# EAGLE design extio (EAGLE 7.1.0)
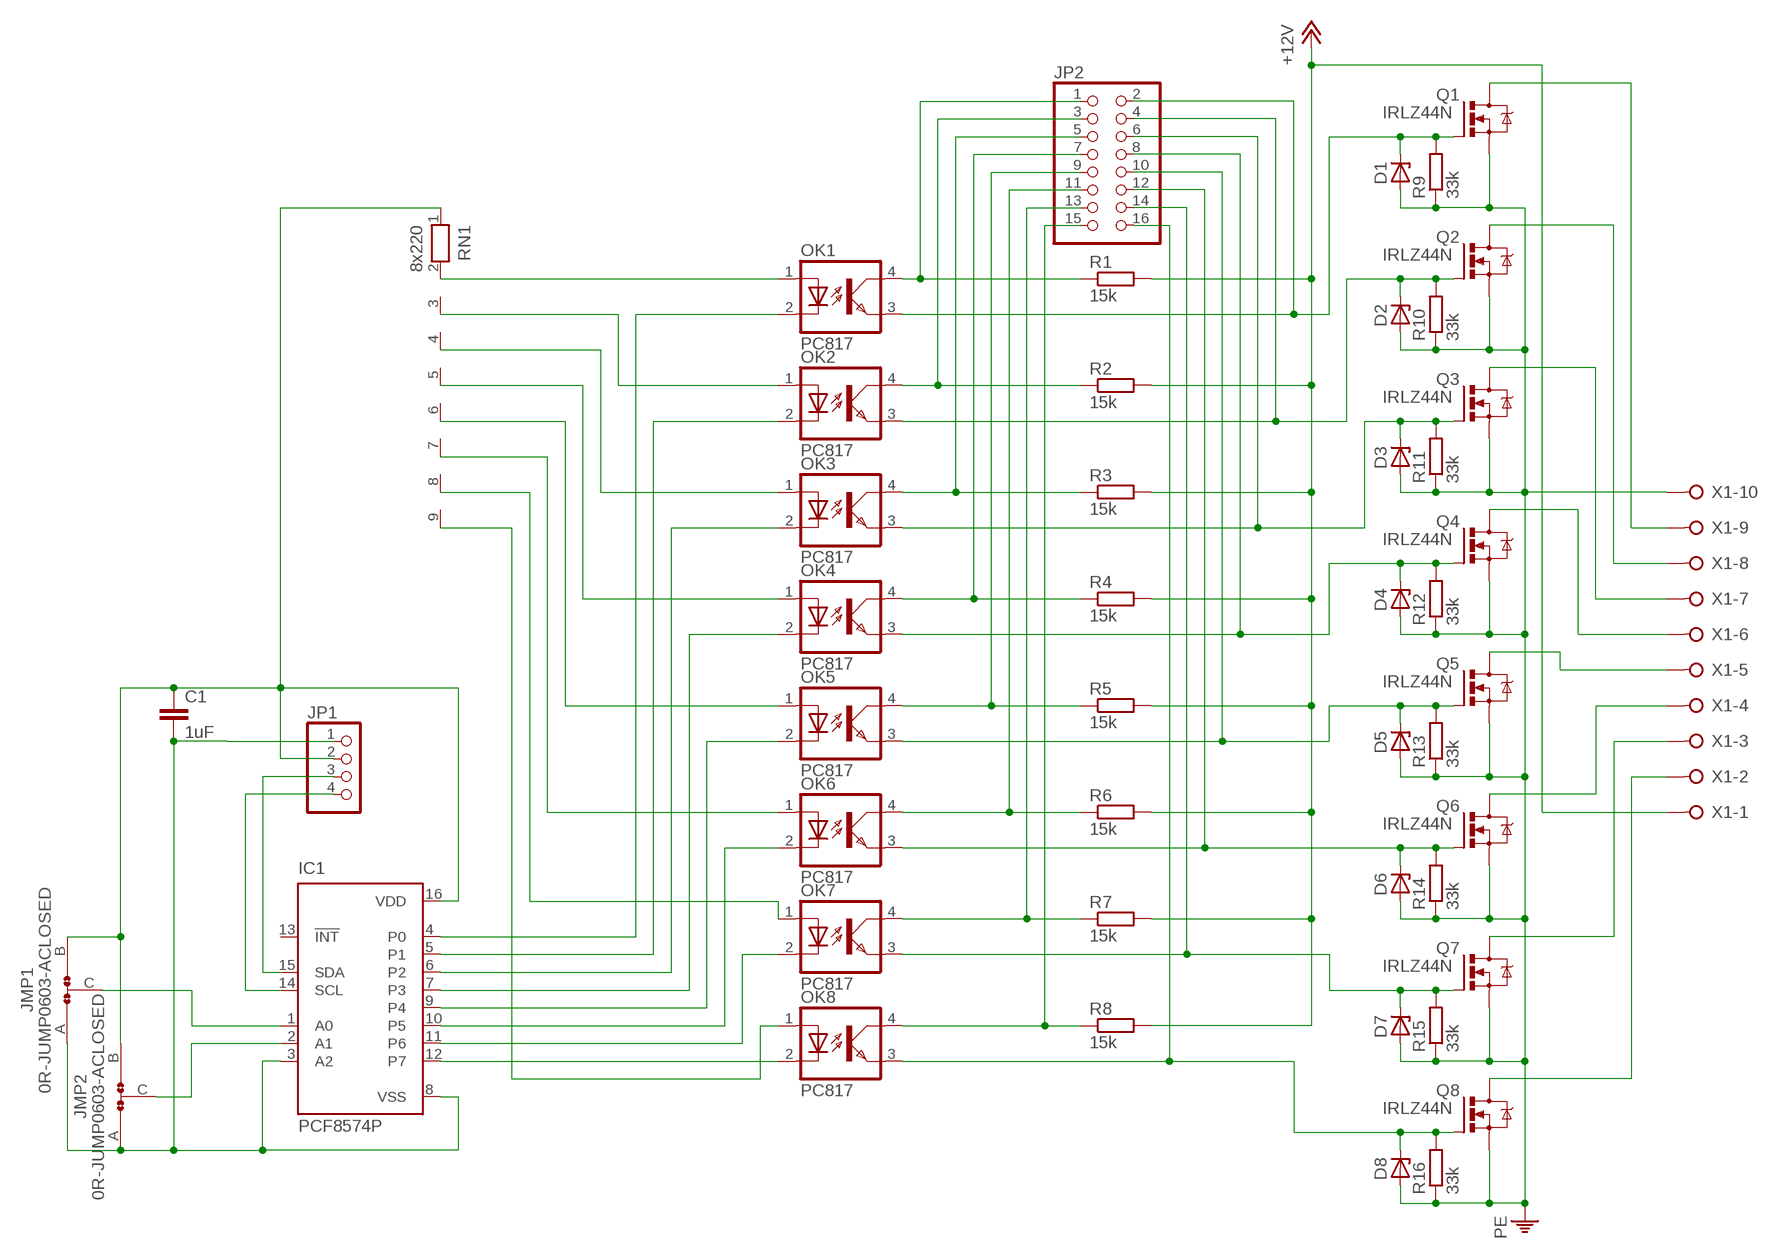
[diagram p0: schematic, sheet 1]

## Parts
C1  1uF  C-EUC0603  [C0603]
D1  ZENER-DIODESOD80C  [SOD80C]
D2  ZENER-DIODESOD80C  [SOD80C]
D3  ZENER-DIODESOD80C  [SOD80C]
D4  ZENER-DIODESOD80C  [SOD80C]
D5  ZENER-DIODESOD80C  [SOD80C]
D6  ZENER-DIODESOD80C  [SOD80C]
D7  ZENER-DIODESOD80C  [SOD80C]
D8  ZENER-DIODESOD80C  [SOD80C]
IC1  PCF8574P  [DIL16]
JMP1  0R-JUMP0603-ACLOSED  [JMP0603-ACLOSED]
JMP2  0R-JUMP0603-ACLOSED  [JMP0603-ACLOSED]
JP1  PINHD-1X4  [1X04]
JP2  PINHD-2X8  [2X08]
OK1  PC817  [DIL04]
OK2  PC817  [DIL04]
OK3  PC817  [DIL04]
OK4  PC817  [DIL04]
OK5  PC817  [DIL04]
OK6  PC817  [DIL04]
OK7  PC817  [DIL04]
OK8  PC817  [DIL04]
Q1  IRLZ44N  [TO220V]
Q2  IRLZ44N  [TO220V]
Q3  IRLZ44N  [TO220V]
Q4  IRLZ44N  [TO220V]
Q5  IRLZ44N  [TO220V]
Q6  IRLZ44N  [TO220V]
Q7  IRLZ44N  [TO220V]
Q8  IRLZ44N  [TO220V]
R1  15k  R-EU_R0603  [R0603]
R2  15k  R-EU_R0603  [R0603]
R3  15k  R-EU_R0603  [R0603]
R4  15k  R-EU_R0603  [R0603]
R5  15k  R-EU_R0603  [R0603]
R6  15k  R-EU_R0603  [R0603]
R7  15k  R-EU_R0603  [R0603]
R8  15k  R-EU_R0603  [R0603]
R9  33k  R-EU_R0603  [R0603]
R10  33k  R-EU_R0603  [R0603]
R11  33k  R-EU_R0603  [R0603]
R12  33k  R-EU_R0603  [R0603]
R13  33k  R-EU_R0603  [R0603]
R14  33k  R-EU_R0603  [R0603]
R15  33k  R-EU_R0603  [R0603]
R16  33k  R-EU_R0603  [R0603]
RN1  8x220  RN08  [RN-9]
X1  W237-10P  [W237-10P]

## Nets
+12V: R1.2 R2.2 R3.2 R4.2 R5.2 R6.2 R7.2 R8.2 X1.1
GND: C1.2 IC1.3(A2) IC1.8(VSS) JMP1.A JMP2.A JP1.1
N$2: IC1.1(A0) JMP1.C
N$3: IC1.2(A1) JMP2.C
N$13: OK1.1(A) RN1.2
N$20: Q1.2(D) X1.9
N$21: JP2.1 OK1.4(COL) R1.1
N$22: JP2.3 OK2.4(COL) R2.1
N$23: JP2.5 OK3.4(COL) R3.1
N$24: JP2.7 OK4.4(COL) R4.1
N$25: JP2.9 OK5.4(COL) R5.1
N$26: JP2.11 OK6.4(COL) R6.1
N$27: JP2.13 OK7.4(COL) R7.1
N$31: IC1.12(P7) OK8.2(C)
N$32: IC1.11(P6) OK7.2(C)
N$34: IC1.10(P5) OK6.2(C)
N$35: IC1.9(P4) OK5.2(C)
N$43: IC1.7(P3) OK4.2(C)
N$44: IC1.6(P2) OK3.2(C)
N$45: IC1.5(P1) OK2.2(C)
N$46: IC1.4(P0) OK1.2(C)
N$47: OK2.1(A) RN1.3
N$48: OK3.1(A) RN1.4
N$49: OK4.1(A) RN1.5
N$50: OK5.1(A) RN1.6
N$51: OK6.1(A) RN1.7
N$52: OK7.1(A) RN1.8
N$53: OK8.1(A) RN1.9
N$54: D1.C JP2.2 OK1.3(EMIT) Q1.1(G) R9.2
N$55: IC1.15(SDA) JP1.3
N$56: JP2.15 OK8.4(COL) R8.1
N$57: D2.C JP2.4 OK2.3(EMIT) Q2.1(G) R10.2
N$60: D3.C JP2.6 OK3.3(EMIT) Q3.1(G) R11.2
N$61: D4.C JP2.8 OK4.3(EMIT) Q4.1(G) R12.2
N$62: D5.C JP2.10 OK5.3(EMIT) Q5.1(G) R13.2
N$63: D6.C JP2.12 OK6.3(EMIT) Q6.1(G) R14.2
N$64: IC1.14(SCL) JP1.4
N$65: D7.C JP2.14 OK7.3(EMIT) Q7.1(G) R15.2
N$66: D8.C JP2.16 OK8.3(EMIT) Q8.1(G) R16.2
N$67: Q2.2(D) X1.8
N$69: C1.1 IC1.16(VDD) JMP1.B JMP2.B JP1.2 RN1.1
N$72: Q3.2(D) X1.7
N$77: Q4.2(D) X1.6
N$81: Q5.2(D) X1.5
N$85: Q6.2(D) X1.4
N$89: Q7.2(D) X1.3
N$93: Q8.2(D) X1.2
PE: D1.A D2.A D3.A D4.A D5.A D6.A D7.A D8.A Q1.3(S) Q2.3(S) Q3.3(S) Q4.3(S) Q5.3(S) Q6.3(S) Q7.3(S) Q8.3(S) R9.1 R10.1 R11.1 R12.1 R13.1 R14.1 R15.1 R16.1 X1.10
Unconnected: IC1.13(!INT)

## Library data of the parts
C1 = resistor:C-EU: CAPACITOR, European symbol; SPICEPREFIX: C
D1-D8 = gate433:ZENER-DIODE: Z-Diode
IC1 = gate433:PCF8574: I2C-Bus Remote 8-bit I/O expander http://www.semiconductors.philips.com/acrobat_download/datasheets/PCF8574_4.pdf; MPN: PCF8574PN; OC_FARNELL: 204020; OC_NEWARK: 11N8515
JMP1 JMP2 = gate433:0R-JUMP: SMD 0R 0805 Jumper
JP1 = gate433:PINHD-1X4: PIN HEADER
JP2 = gate433:PINHD-2X8: PIN HEADER
OK1-OK8 = gate433:PC817: SHARP OPTO COUPLER; MPN: PC817X4J000F; OC_FARNELL: 9707727; OC_NEWARK: 97K7059
Q1-Q8 = gate433:IRLZ44N: N-Channel HEXFET® Power MOSFET Logic Level AUTOMOTIVE MOSFET Source: http://www.irf.com/product-info/datasheets/data/irlz44n.pdf
R1-R16 = resistor:R-EU_: RESISTOR, European symbol; SPICEPREFIX: R
RN1 = gate433:RN08: RESISTOR NETWORK; OC_FARNELL: unknown; OC_NEWARK: unknown
X1 = gate433:W237-10P: WAGO SREW CLAMP; OC_FARNELL: unknown; OC_NEWARK: unknown

## Board
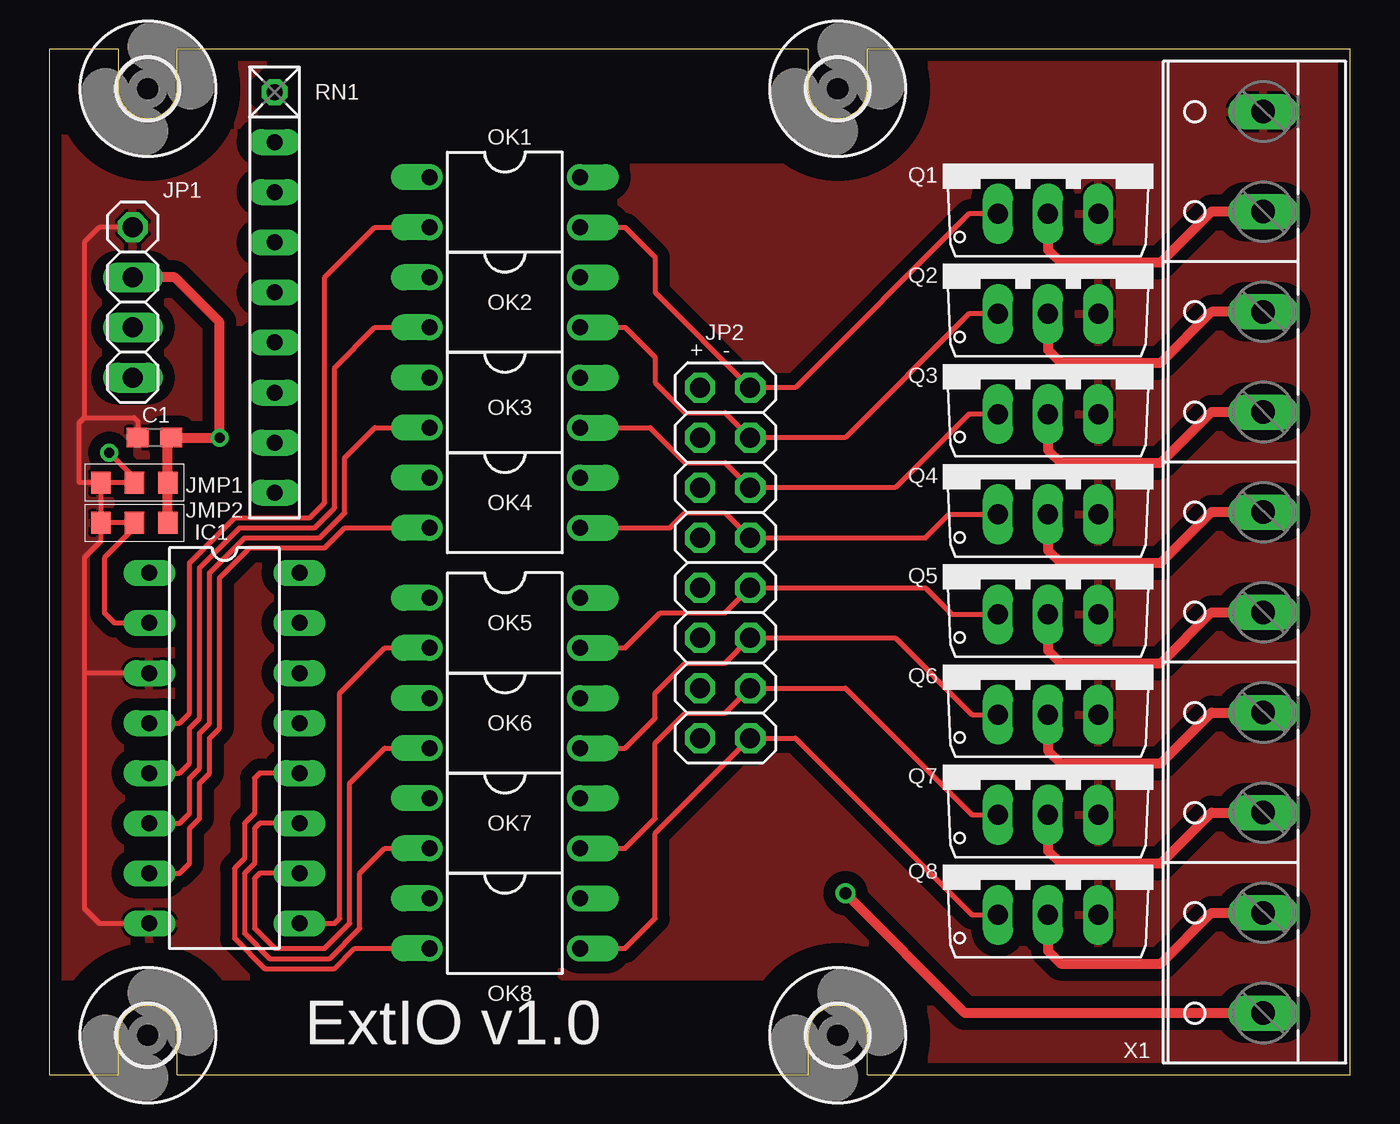
[diagram p1: board, top side]
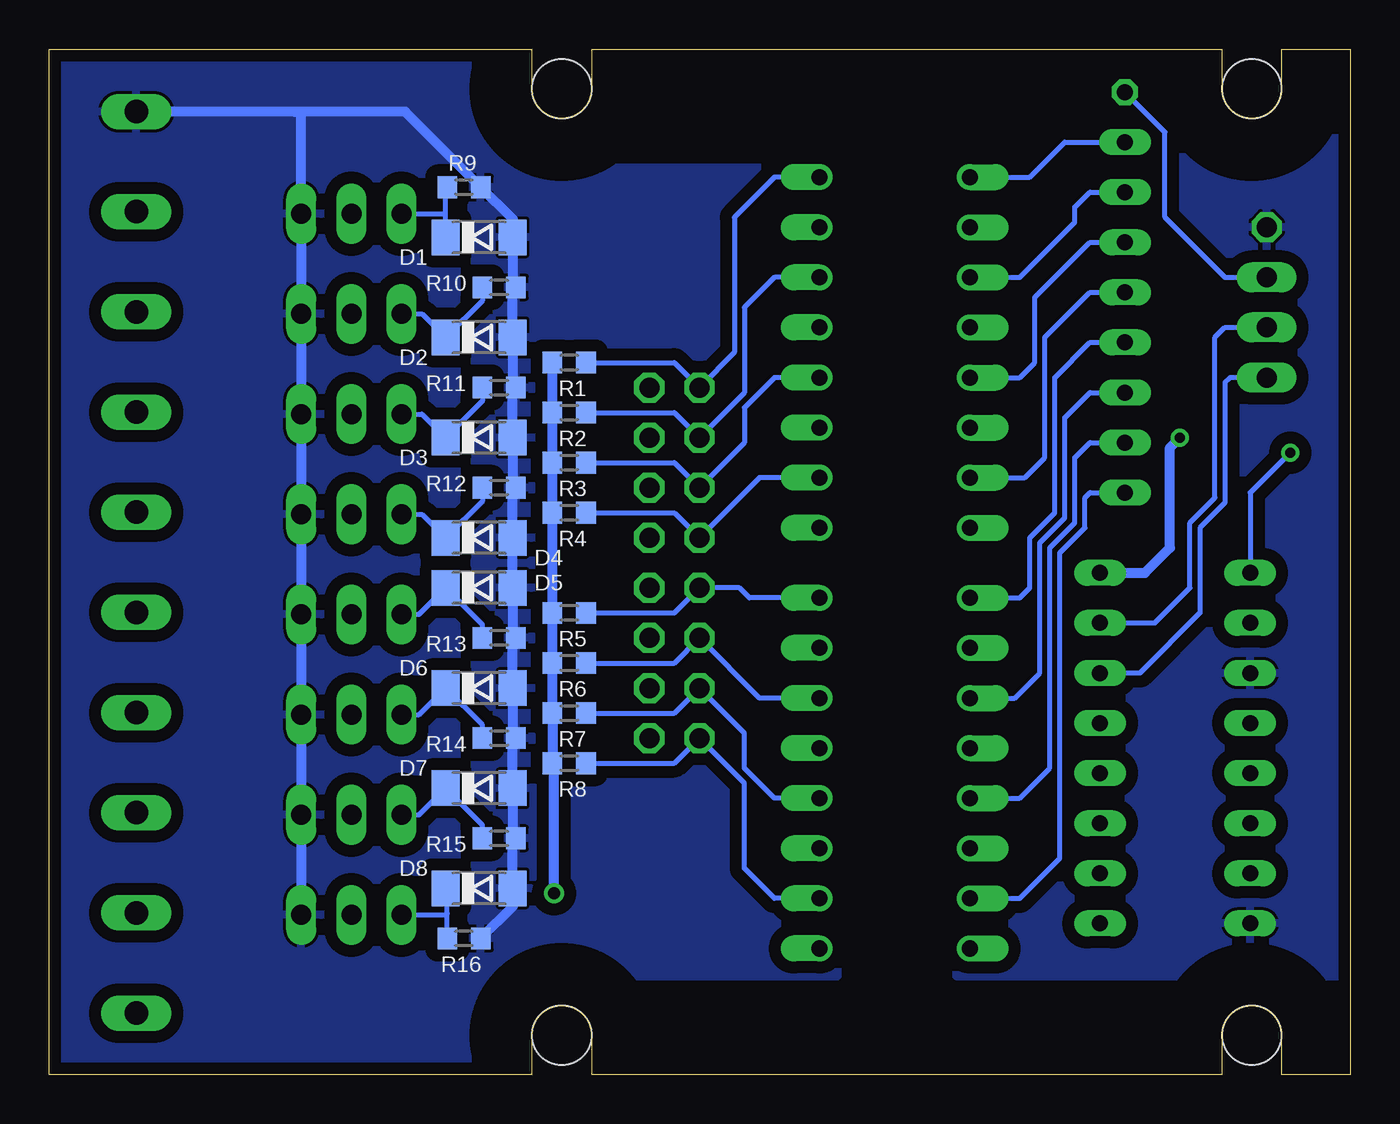
[diagram p2: board, bottom side, seen from below]

Size 66 x 52 mm. Coordinates in mm from the lower left corner, seen from the top.
Outline: 0,0 3.5,0 3.5,2 arc-180 6.5,2 6.5,0 38.5,0 38.5,2 arc-180 41.5,2 41.5,0 66,0 66,52 41.5,52 41.5,50 arc-180 38.5,50 38.5,52 6.5,52 6.5,50 arc-180 3.5,50 3.5,52 0,52 0,0
Copper layers (1*16): Top 0.035mm / dielectric 1.5mm / Bottom 0.035mm
Design rules "NYAKARUHAZ_StandardNYAK": minimum track width 6mil, minimum drill 12mil, track to track 6mil, track to pad 6mil, pad to pad 6mil, via to via 6mil, smd to smd 6mil, copper to edge 20mil, drill to drill 8mil, minimum pad ring 10mil, minimum via ring 8mil, stop-mask expansion 4mil, vias tented up to drill 0mil, thermal gap 6mil

### Footprints (pad centres in the part's own frame; a part is rotated, then mirrored left to right if it is on the bottom)
C0603 = smd 1.1 x 1: 1 -0.85,0; 2 0.85,0
SOD80C = smd 1.4 x 1.8: A 1.7,0; C -1.7,0
DIL16 = drill 0.813 long: 1 -8.89,-3.81; 2 -6.35,-3.81; 3 -3.81,-3.81; 4 -1.27,-3.81; 5 1.27,-3.81; 6 3.81,-3.81; 7 6.35,-3.81; 8 8.89,-3.81; 9 8.89,3.81; 10 6.35,3.81; 11 3.81,3.81; 12 1.27,3.81; 13 -1.27,3.81; 14 -3.81,3.81; 15 -6.35,3.81; 16 -8.89,3.81
JMP0603-ACLOSED = smd 1 x 1.1: A -1.7,0; B 1.7,0; C 0,0
1X04 = drill 1.016 octagon: 1 -3.81,0 | drill 1.016 long: 2 -1.27,0; 3 1.27,0; 4 3.81,0
2X08 = drill 1.016 octagon: 1 -8.89,-1.27; 2 -8.89,1.27; 3 -6.35,-1.27; 4 -6.35,1.27; 5 -3.81,-1.27; 6 -3.81,1.27; 7 -1.27,-1.27; 8 -1.27,1.27; 9 1.27,-1.27; 10 1.27,1.27; 11 3.81,-1.27; 12 3.81,1.27; 13 6.35,-1.27; 14 6.35,1.27; 15 8.89,-1.27; 16 8.89,1.27
DIL04 = drill 0.813 offset: 1 -1.27,-3.81; 2 1.27,-3.81; 3 1.27,3.81; 4 -1.27,3.81
TO220V = drill 1.016 long: 1 -2.54,-2.54; 2 0,-2.54; 3 2.54,-2.54
R0603 = smd 1 x 1.1: 1 -0.85,0; 2 0.85,0
RN-9 = drill 0.813 octagon: 1 -10.16,0 | drill 0.813 long: 2 -7.62,0; 3 -5.08,0; 4 -2.54,0; 5 0,0; 6 2.54,0; 7 5.08,0; 8 7.62,0; 9 10.16,0
3,0 = hole 3: 0,0
W237-10P = drill 1.194 long: 1 -22.86,-0.635; 2 -17.78,-0.635; 3 -12.7,-0.635; 4 -7.62,-0.635; 5 -2.54,-0.635; 6 2.54,-0.635; 7 7.62,-0.635; 8 12.7,-0.635; 9 17.78,-0.635; 10 22.86,-0.635

### Placement (x,y rotation side)
C1  5.33,32.31 180 top
D1  44.2,42.47 0 bottom
D2  44.2,37.39 0 bottom
D3  44.2,32.31 0 bottom
D4  44.2,27.23 0 bottom
D5  44.2,24.69 0 bottom
D6  44.2,19.61 0 bottom
D7  44.2,14.53 0 bottom
D8  44.2,9.45 0 bottom
IC1  8.89,16.56 270 top
JMP1  4.32,30.02 0 top
JMP2  4.32,27.99 0 top
JP1  4.24,39.16 270 top
JP2  34.29,25.96 270 top
OK1  23.11,44.24 270 top
OK2  23.11,39.16 270 top
OK3  23.11,34.08 270 top
OK4  23.11,29 270 top
OK5  23.11,22.91 270 top
OK6  23.11,17.83 270 top
OK7  23.11,12.75 270 top
OK8  23.11,7.67 270 top
Q1  50.67,46.2 0 top
Q2  50.67,41.12 0 top
Q3  50.67,36.04 0 top
Q4  50.67,30.96 0 top
Q5  50.67,25.88 0 top
Q6  50.67,20.8 0 top
Q7  50.67,15.72 0 top
Q8  50.67,10.64 0 top
R1  39.62,36.12 180 bottom
R2  39.62,33.58 180 bottom
R3  39.62,31.04 180 bottom
R4  39.62,28.5 180 bottom
R5  39.62,23.42 180 bottom
R6  39.62,20.88 180 bottom
R7  39.62,18.34 180 bottom
R8  39.62,15.8 180 bottom
R9  44.96,45.01 180 bottom
R10  43.18,39.93 180 bottom
R11  43.18,34.85 180 bottom
R12  43.18,29.77 180 bottom
R13  43.18,22.15 180 bottom
R14  43.18,17.07 180 bottom
R15  43.18,11.99 180 bottom
R16  44.96,6.91 180 bottom
RN1  11.43,39.67 270 top
U$1  [3,0]  5,50 0 top
U$2  [3,0]  5,2 0 top
U$3  [3,0]  40,2 0 top
U$4  [3,0]  40,50 0 top
X1  60.95,25.98 90 top

### Tracks (layer width: path | path; a pad name or v marks a point on that pad's centre or on a via)
+12V  (via drill 0.6)
  Top 0.508: v40.39,9.19 46.45,3.12 X1.1
  Bottom 0.508: v40.39,9.19 40.39,15.71 R8.2 R7.2 R6.2 R5.2 R4.2 R3.2 R2.2 R1.2
GND
  Top 0.254: JP1.1 2.54,42.97 1.78,42.21 1.78,33.32 | 1.78,33.32 4.32,33.32 4.48,33.16 C1.2 | 1.78,33.32 1.52,33.07 1.52,30.02 JMP1.A JMP2.A 2.62,27.05 1.78,26.21 1.78,20.37 | 1.78,20.37 1.78,8.43 2.54,7.67 IC1.8 | IC1.3 1.78,20.37
  pour Top (isolate 0.61): 20,52 0,52 0,5 20,5
  pour Bottom (isolate 0.61): 0,52 20,52 20,5 0,5
N$2  (via drill 0.5)
  Top 0.254: JMP1.C 4.32,30.27 v3.05,31.54
  Bottom 0.254: v3.05,31.54 5.08,29.51 IC1.1
N$3
  Top 0.254: JMP2.C 4.32,27.73 2.79,26.21 2.79,23.42 3.3,22.91 IC1.2
N$13
  Bottom 0.254: RN1.2 14.48,47.29 16.26,45.51 OK1.1
N$20
  Top 0.508: Q1.2 50.67,41.83 51.31,41.2 56.39,41.2 58.96,43.76 X1.9
N$21
  Bottom 0.254: OK1.4 29.21,45.51 31.24,43.48 31.24,36.62 JP2.1 34.29,36.12 R1.1
N$22
  Bottom 0.254: OK2.4 29.21,40.43 30.73,38.91 30.73,34.59 JP2.3 34.29,33.58 R2.1
N$23
  Bottom 0.254: OK3.4 29.21,35.35 30.73,33.83 30.73,32.05 JP2.5 34.29,31.04 R3.1
N$24
  Bottom 0.254: OK4.4 29.97,30.27 JP2.7 34.29,28.5 R4.1
N$25
  Bottom 0.254: OK5.4 30.48,24.18 30.99,24.69 JP2.9 34.29,23.42 R5.1
N$26
  Bottom 0.254: OK6.4 29.97,19.1 JP2.11 34.29,20.88 R6.1
N$27
  Bottom 0.254: OK7.4 29.21,14.02 30.73,15.54 30.73,17.32 JP2.13 34.29,18.34 R7.1
N$31
  Top 0.254: IC1.12 10.67,15.29 10.41,15.03 10.41,13.26 9.91,12.75 9.91,10.97 9.4,10.46 9.4,6.91 10.92,5.38 14.48,5.38 15.49,6.4 OK8.2
N$32
  Top 0.254: IC1.11 10.67,12.75 10.41,12.49 10.41,10.72 9.91,10.21 9.91,7.16 11.18,5.89 14.22,5.89 15.75,7.41 15.75,10.21 17.02,11.48 OK7.2
N$34
  Top 0.254: IC1.10 10.67,10.21 10.41,9.95 10.41,7.41 11.43,6.4 13.97,6.4 15.24,7.67 15.24,14.78 17.02,16.56 OK6.2
N$35
  Top 0.254: IC1.9 14.48,7.67 14.73,7.92 14.73,19.35 17.02,21.64 OK5.2
N$43
  Top 0.254: IC1.7 6.6,10.21 7.11,10.72 7.11,12.49 7.62,13 7.62,14.78 8.13,15.29 8.13,17.07 8.64,17.57 8.64,25.19 10.16,26.72 13.97,26.72 14.99,27.73 OK4.2
N$44
  Top 0.254: IC1.6 6.6,12.75 7.11,13.26 7.11,15.03 7.62,15.54 7.62,17.32 8.13,17.83 8.13,25.45 9.91,27.23 13.72,27.23 14.99,28.5 14.99,31.29 16.51,32.81 OK3.2
N$45
  Top 0.254: IC1.5 6.6,15.29 7.11,15.8 7.11,17.57 7.62,18.08 7.62,25.7 9.65,27.73 13.46,27.73 14.48,28.75 14.48,35.86 16.51,37.89 OK2.2
N$46
  Top 0.254: IC1.4 6.6,17.83 7.11,18.34 7.11,25.96 9.4,28.24 13.21,28.24 13.97,29 13.97,40.43 16.51,42.97 OK1.2
N$47
  Bottom 0.254: OK2.1 16.76,40.43 13.97,43.23 13.97,43.99 13.21,44.75 RN1.3
N$48
  Bottom 0.254: RN1.4 13.21,42.21 16,39.42 16,36.12 16.76,35.35 OK3.1
N$49
  Bottom 0.254: OK4.1 16.51,30.27 15.49,31.29 15.49,37.39 13.21,39.67 RN1.5
N$50
  Bottom 0.254: OK5.1 16.76,24.18 16.26,24.69 16.26,27.23 14.99,28.5 14.99,35.1 14.99,35.35 13.21,37.13 RN1.6
N$51
  Bottom 0.254: OK6.1 17.02,19.1 15.75,20.37 15.75,26.97 14.48,28.24 14.48,33.32 13.21,34.59 RN1.7
N$52
  Bottom 0.254: OK7.1 16.76,14.02 15.24,15.54 15.24,26.72 13.97,27.99 13.97,31.29 13.21,32.05 RN1.8
N$53
  Bottom 0.254: OK8.1 16.76,8.94 14.73,10.97 14.73,26.46 13.46,27.73 13.46,29.26 13.21,29.51 RN1.9
N$54
  Top 0.254: Q1.1 46.66,43.66 37.85,34.85 JP2.2 30.73,39.67 30.73,41.45 29.21,42.97 OK1.3
  Bottom 0.254: D1.C 45.9,43.74 | 45.9,43.74 45.9,44.92 R9.2 | Q1.1 45.97,43.66 45.9,43.74
N$55
  Bottom 0.254: IC1.15 9.91,22.91 8.13,24.69 8.13,27.99 6.86,29.26 6.86,37.39 6.35,37.89 JP1.3
N$56
  Bottom 0.254: OK8.4 29.21,8.94 30.73,10.46 30.73,14.78 JP2.15 34.29,15.8 R8.1
N$57
  Top 0.254: Q2.1 46.66,38.58 40.39,32.31 JP2.4 34.29,33.58 32.26,33.58 30.73,35.1 30.73,36.37 29.21,37.89 OK2.3
  Bottom 0.254: R10.2 44.03,39.25 D2.C 47.09,38.58 Q2.1
N$60
  Top 0.254: Q3.1 46.66,33.5 42.93,29.77 JP2.6 34.29,31.04 32.26,31.04 30.48,32.81 OK3.3
  Bottom 0.254: R11.2 44.03,34.17 D3.C 47.09,33.5 Q3.1
N$61
  Top 0.254: Q4.1 45.64,28.42 44.45,27.23 JP2.8 34.29,28.5 32.26,28.5 31.5,27.73 OK4.3
  Bottom 0.254: R12.2 44.03,29.09 D4.C 47.09,28.42 Q4.1
N$62
  Top 0.254: Q5.1 45.8,23.34 44.45,24.69 JP2.10 34.29,23.42 30.99,23.42 29.21,21.64 OK5.3
  Bottom 0.254: R13.2 44.03,22.82 D5.C 47.24,23.34 Q5.1
N$63
  Top 0.254: Q6.1 46.81,18.26 42.93,22.15 JP2.12 34.29,20.88 32.26,20.88 30.73,19.35 30.73,18.08 29.21,16.56 OK6.3
  Bottom 0.254: R14.2 44.03,17.74 D6.C 47.24,18.26 Q6.1
N$64
  Bottom 0.254: JP1.4 6.1,35.35 6.35,35.1 6.35,35.02 6.35,29 7.62,27.73 7.62,23.42 10.67,20.37 IC1.14
N$65
  Top 0.254: Q7.1 46.81,13.18 40.39,19.61 JP2.14 34.29,18.34 32.26,18.34 30.73,16.81 30.73,13 29.21,11.48 OK7.3
  Bottom 0.254: R15.2 44.03,12.66 D7.C 47.24,13.18 Q7.1
N$66
  Top 0.254: Q8.1 46.81,8.1 37.85,17.07 JP2.16 30.73,12.24 30.73,7.92 29.21,6.4 OK8.3
  Bottom 0.254: R16.2 45.81,8.18 | 45.81,8.18 45.81,9.36 D8.C | Q8.1 45.88,8.1 45.81,8.18
N$67
  Top 0.508: Q2.2 50.67,36.75 51.31,36.12 56.39,36.12 58.96,38.68 X1.8
N$69  (via drill 0.5)
  Top 0.508: JP1.2 6.35,40.43 8.64,38.15 v8.64,32.31 C1.1 6.02,32.14 JMP1.B JMP2.B
  Bottom 0.254: JP1.2 6.35,40.43 9.4,43.48 9.4,47.8 RN1.1
  Bottom 0.508: IC1.16 10.41,25.45 9.14,26.72 9.14,31.8 v8.64,32.31
N$72
  Top 0.508: Q3.2 50.67,31.67 51.31,31.04 56.39,31.04 58.96,33.6 X1.7
N$77
  Top 0.508: Q4.2 50.67,26.59 51.31,25.96 56.39,25.96 58.96,28.52 X1.6
N$81
  Top 0.508: Q5.2 50.67,21.51 51.31,20.88 56.39,20.88 58.96,23.44 X1.5
N$85
  Top 0.508: Q6.2 50.67,16.43 51.31,15.8 56.39,15.8 58.96,18.36 X1.4
N$89
  Top 0.508: Q7.2 50.67,11.35 51.31,10.72 56.39,10.72 58.96,13.28 X1.3
N$93
  Top 0.508: Q8.2 50.67,6.27 51.31,5.64 56.39,5.64 58.96,8.2 X1.2
PE
  Bottom 0.508: Q8.3 Q7.3 Q6.3 Q5.3 Q4.3 Q3.3 Q2.3 Q1.3 53.21,48.72 53.34,48.84 53.59,48.84 | 53.59,48.84 47.95,48.84 R9.1 42.5,43.39 D1.A 42.5,40.09 R10.1 42.5,39.76 D2.A 42.5,35.01 R11.1 42.5,34.68 D3.A 42.5,29.93 R12.1 42.5,29.6 D4.A D5.A 42.5,22.31 R13.1 42.5,21.98 D6.A 42.5,17.23 R14.1 42.5,16.9 D7.A 42.5,12.15 R15.1 42.5,11.82 D8.A 42.5,8.52 R16.1 | 53.59,48.84 X1.10
  pour Bottom (isolate 0.61): 40,52 66,52 66,0 40,0 40,5 26,5 26,46 40,46
  pour Top (isolate 0.61): 66,52 40,52 40,46 26,46 26,5 40,5 40,0 66,0

### Text on the board
tPlace: + - | ExtIO v1.0